# EAGLE schematic lit-pic1 (EAGLE 9.5.2)

## Sheet 1 of 2
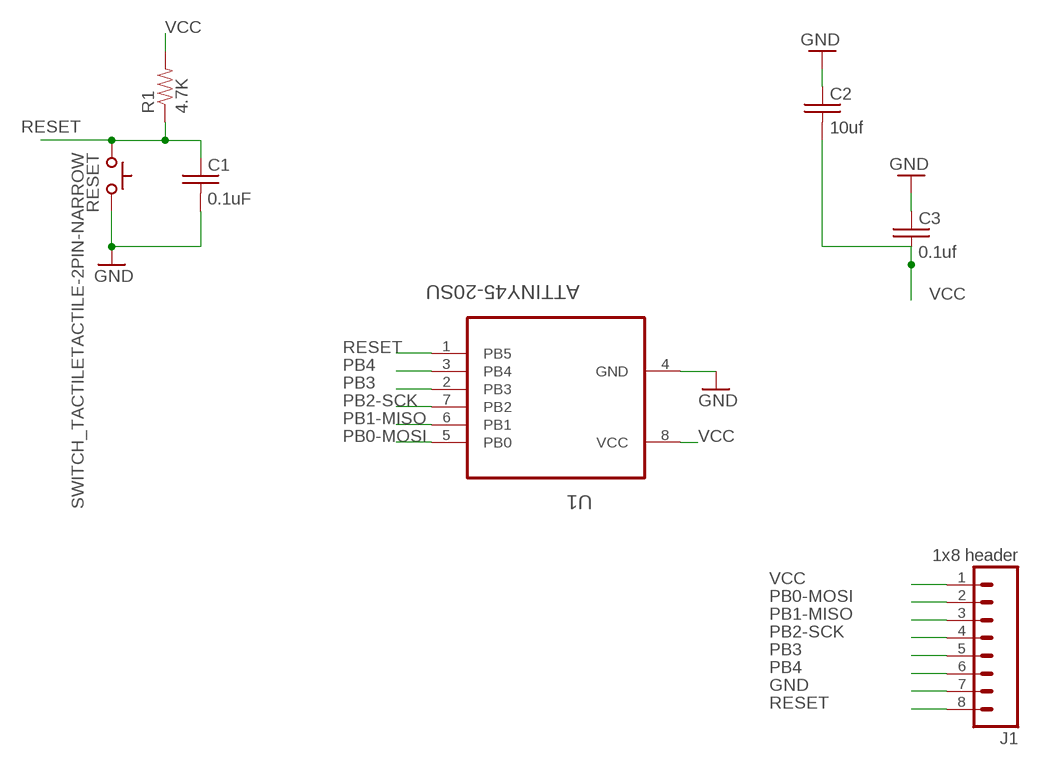
[diagram p0: schematic, sheet 1]

### Parts
C1  0.1uF  C-USC0805K  [C0805K]
C2  10uf  C-USC0805K  [C0805K]
C3  0.1uf  C-USC0805K  [C0805K]
J1  1x8 header  M08SILK_FEMALE_PTH  [1X08]
R1  4.7K  RESISTORR0805-RES  [R0805]
RESET  SWITCH_TACTILETACTILE-2PIN-NARROW  [TACTILE-2PIN-NARROW]
U1  ATTINY45-20SU  [SOIC127P798X216-8N]

### Nets
GND: C1.2 C2.1 C3.1 J1.7 RESET.P$1(A) U1.4(GND) ; also sheet 2
PB0-MOSI: J1.2 U1.5(PB0) ; also sheet 2
PB1-MISO: J1.3 U1.6(PB1)
PB2-SCK: J1.4 U1.7(PB2) ; also sheet 2
PB3: J1.5 U1.2(PB3)
PB4: J1.6 U1.3(PB4)
RESET: C1.1 J1.8 R1.1 RESET.P$2(C) U1.1(PB5)
VCC: C2.2 C3.2 J1.1 R1.2 U1.8(VCC) ; also sheet 2

## Sheet 2 of 2
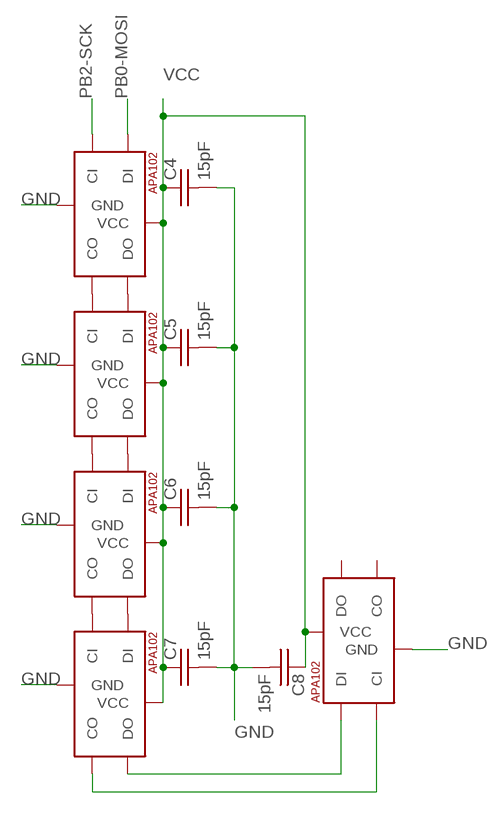
[diagram p1: schematic, sheet 2]

### Parts
C4  15pF  C-USC0805K  [C0805K]
C5  15pF  C-USC0805K  [C0805K]
C6  15pF  C-USC0805K  [C0805K]
C7  15pF  C-USC0805K  [C0805K]
C8  15pF  C-USC0805K  [C0805K]
U$1  APA1025050  [APA102_5050]
U$2  APA1025050  [APA102_5050]
U$3  APA1025050  [APA102_5050]
U$4  APA1025050  [APA102_5050]
U$5  APA1025050  [APA102_5050]

### Nets
GND: C4.2 C5.2 C6.2 C7.2 C8.2 U$1.6(GND) U$2.6(GND) U$3.6(GND) U$4.6(GND) U$5.6(GND) ; also sheet 1
N$3: U$1.2(CO) U$2.5(CI)
N$4: U$1.3(DO) U$2.4(DI)
N$7: U$3.2(CO) U$4.5(CI)
N$8: U$3.3(DO) U$4.4(DI)
N$9: U$2.2(CO) U$3.5(CI)
N$10: U$2.3(DO) U$3.4(DI)
N$41: U$4.3(DO) U$5.4(DI)
N$42: U$4.2(CO) U$5.5(CI)
PB0-MOSI: U$1.4(DI) ; also sheet 1
PB2-SCK: U$1.5(CI) ; also sheet 1
VCC: C4.1 C5.1 C6.1 C7.1 C8.1 U$1.1(VCC) U$2.1(VCC) U$3.1(VCC) U$4.1(VCC) U$5.1(VCC) ; also sheet 1
Unconnected: U$5.2(CO) U$5.3(DO)

## Library data of the parts
C1-C3 = name-in-lights:C-US: CAPACITOR, American symbol
C4-C8 = passives:C-US: CAPACITOR, American symbol
J1 = NameInLights:M08: Header 8 Standard 8-pin 0.1" header. Use with straight break away headers (SKU : PRT-00116), right angle break away headers (PRT-00553), swiss pins (PRT-00743), machine pins (PRT-00117), and female headers (PRT-00115).; PROD_ID: CONN-08438
R1 = passives:RESISTOR: Resistor Basic schematic elements and footprints for 0603, 1206, and PTH resistors.
RESET = NameInLights:SWITCH_TACTILE
U1 = ICs:ATTINY45-20SU: 8-bit Microcontroller with 4 Bytes In-System Programmable Flash; DESCRIPTION: ATtiny Series 20 MHz 4 KB Flash 256 B SRAM 8-Bit Microcontroller - SOIC-8; DIGI-KEY_PART_NUMBER: ATTINY45-20SU-ND; DIGI-KEY_PURCHASE_URL: https://www.digikey.com/product-detail/en/microchip-technology/ATTINY45-20SU/ATTINY45-20SU-ND/735466?utm_source=snapeda&utm_medium=aggregator&utm_campaign=symbol; MF: Microchip; MP: ATTINY45-20SU; PACKAGE: SOIC-8 Microchip
U$1-U$5 = leds:APA102: APA102C 5050 RGB LED -- Adafruit DotStar Single LED Pixel Product Page: https://www.adafruit.com/products/2343 Datasheet: https://cdn-shop.adafruit.com/product-files/2343/APA102C.pdf